# EAGLE design schemat (EAGLE 5.11)
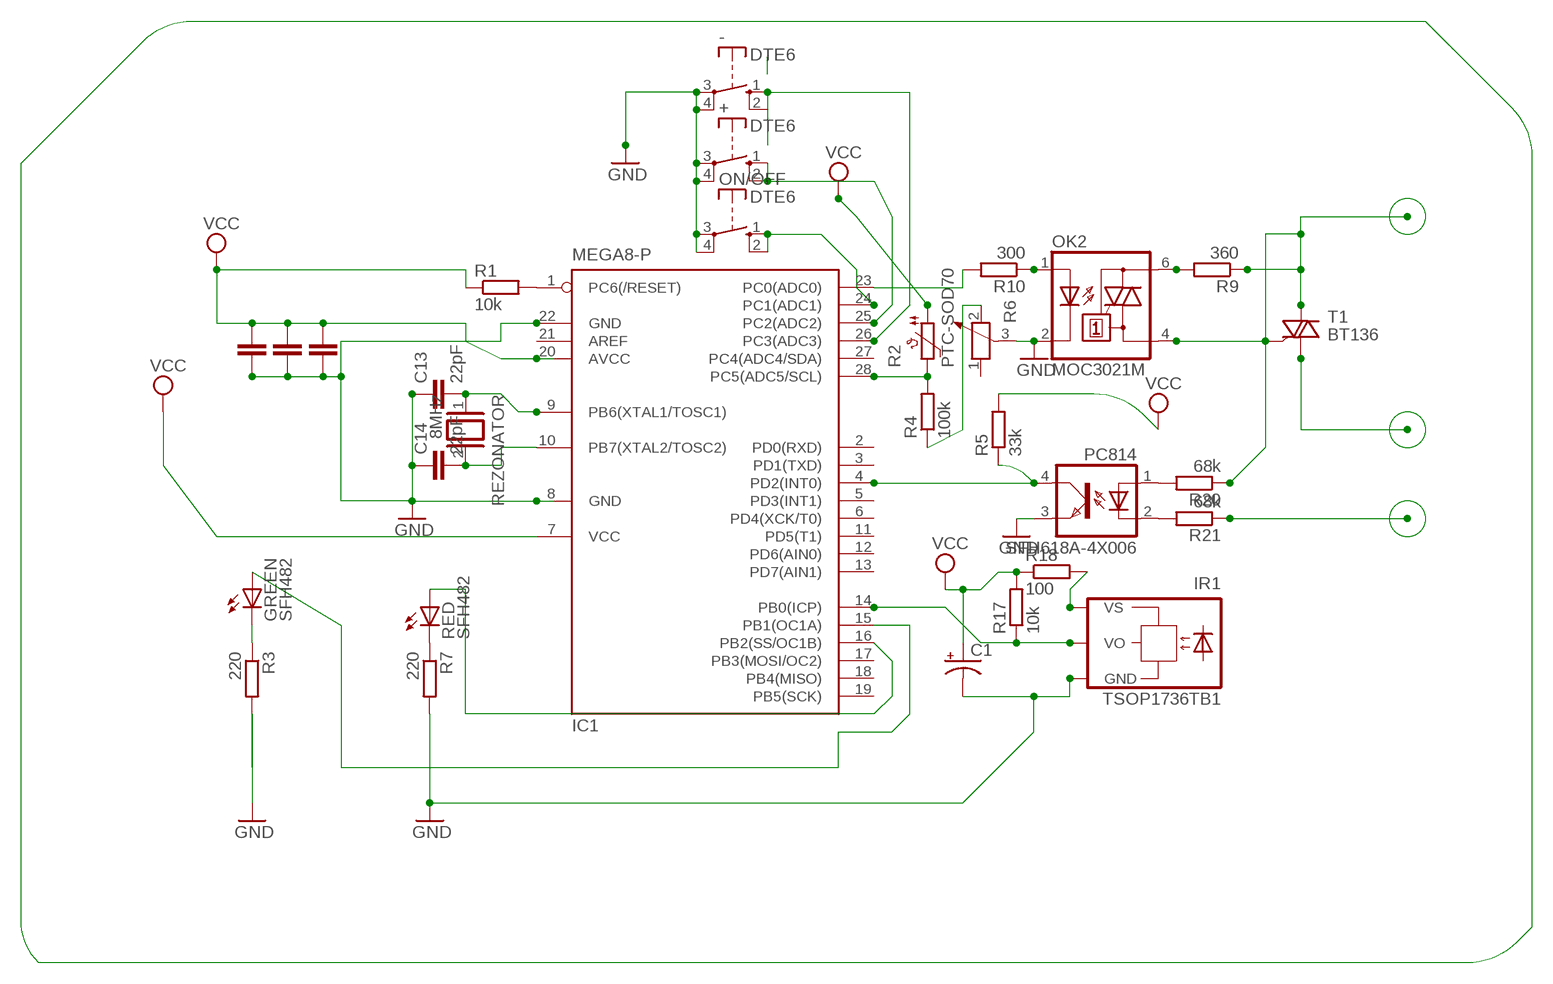
[diagram p0: schematic, sheet 1]

## Parts
+  DTE6  [DTE6]
-  DTE6  [DTE6]
C1  CPOL-USE2.5-7  [E2,5-7]
C13  22pF  C-EU050-024X044  [C050-024X044]
C14  22pF  C-EU050-024X044  [C050-024X044]
GREEN  SFH482  [SFH482]
IC1  MEGA8-P  [DIL28-3]
IR1  TSOP1736TB1  [TSOP17_TB1]
OK2  MOC3021M  [DIL06]
ON/OFF  DTE6  [DTE6]
PC814  SFH618A-4X006  [DIP4-400]
R1  10k  R-EU_0204/2V  [0204V]
R2  PTC-SOD70  [SOD70]
R3  220  R-EU_0309/12  [0309/12]
R4  100k  R-EU_0309/12  [0309/12]
R5  33k  R-EU_0309/12  [0309/12]
R6  POTENTIOMETER_PT-10  [PT-10]
R7  220  R-EU_0309/12  [0309/12]
R9  360  R-EU_0309/12  [0309/12]
R10  300  R-EU_0309/12  [0309/12]
R17  10k  R-EU_0309/12  [0309/12]
R18  100  R-EU_0309/12  [0309/12]
R20  68k  R-EU_0309/12  [0309/12]
R21  68k  R-EU_0309/12  [0309/12]
RED  SFH482  [SFH482]
REZONATOR  8MHz  XTAL/S  [QS]
T1  BT136  [TO220AB]

## Nets
GND: +.3(P) +.4(P) -.3(P) -.4(P) C1.- C13.1 C14.1 IC1.8(GND) IC1.22(GND) IR1.GND OK2.2(C) ON/OFF.3(P) ON/OFF.4(P) PC814.3(EMIT) R3.2 R6.3 R7.2
N$1: IC1.1(PC6(/RESET)) R1.2
N$2: C14.2 IC1.10(PB7(XTAL2/TOSC2)) REZONATOR.2
N$3: C13.2 IC1.9(PB6(XTAL1/TOSC1)) REZONATOR.1
N$4: IC1.23(PC0(ADC0)) R10.2
N$5: R9.1 R20.1 T1.2(A2)
N$6: OK2.4(A1) T1.3(G)
N$7: T1.1(A1)
N$8: PC814.1(A) R20.2
N$9: PC814.2(C) R21.2
N$10: IC1.4(PD2(INT0)) PC814.4(COL) R5.1
N$12: R21.1
N$14: IC1.14(PB0(ICP)) IR1.VO R17.1
N$16: IR1.VS R18.2
N$17: -.1(S) -.2(S) IC1.26(PC3(ADC3))
N$18: GREEN.A IC1.15(PB1(OC1A))
N$19: IC1.24(PC1(ADC1)) ON/OFF.1(S) ON/OFF.2(S)
N$20: IC1.28(PC5(ADC5/SCL)) R2.2 R4.2
N$21: IC1.16(PB2(SS/OC1B)) RED.A
N$22: GREEN.K(C) R3.1
N$23: R7.1 RED.K(C)
N$24: +.1(S) +.2(S) IC1.25(PC2(ADC2))
N$25: OK2.6(A2) R9.2
N$26: OK2.1(A) R10.1
N$31: R4.1 R6.2
VCC: C1.+ IC1.7(VCC) IC1.20(AVCC) R1.1 R2.1 R5.2 R17.2 R18.1
Unconnected: IC1.2(PD0(RXD)) IC1.3(PD1(TXD)) IC1.5(PD3(INT1)) IC1.6(PD4(XCK/T0)) IC1.11(PD5(T1)) IC1.12(PD6(AIN0)) IC1.13(PD7(AIN1)) IC1.17(PB3(MOSI/OC2)) IC1.18(PB4(MISO)) IC1.19(PB5(SCK)) IC1.21(AREF) IC1.27(PC4(ADC4/SDA)) R6.1

## Library data of the parts
+ - ON/OFF = switch-misc:DT: ITT SWITCH
C1 = rcl:CPOL-US: POLARIZED CAPACITOR, American symbol
C13 C14 = rcl:C-EU: CAPACITOR, European symbol
GREEN RED = led:SFH482: IR LED infrared emitting diode, Infineon
IC1 = atmel:MEGA8-P: MICROCONTROLLER 8 Kbytes FLASH, 1 kbytes SRAM, 512 bytes EEPROM, USART, 4-channel 10 bit ADC, 2-channel 8 bit ADC Pin compatible with Atmega48, ATMega88, ATMega168 Source: avr.lbr; OC_FARNELL: unknown; OC_NEWARK: unknown
IR1 = telefunken:TSOP17*TB1: TSOP17..TB1 IR Receiver Modules for Remote Control Systems Source: http://www.vishay.com/docs/82042/82042.pdf; OC_FARNELL: unknown; OC_NEWARK: unknown
OK2 = optocoupler:MOC30*M: RANDOM-PHASE OPTOISOLATORS TRIAC DRIVER OUTPUT Source: http://www.fairchildsemi.com MOC3020-M.pdf; MF: FAIRCHILD SEMICONDUCTOR; MPN: MOC3021-M; OC_FARNELL: 1021365; OC_NEWARK: 95B7895
PC814 = optocoupler:SFH618?*: Optocoupler, Phototransistor Output, Low Input Current Source: http://www.vishay.com/docs/83673/sfh618.pdf; OC_FARNELL: unknown; OC_NEWARK: unknown
R1 = resistor:R-EU_: RESISTOR, European symbol
R2 = ptc-ntc:PTC-: Positive Temperature Coefficient Resistor (PTC) termistor Philips KTY81-210 - KTY81-252 Source: 153627-da-01-en-Temperatur-Sensor_KTY10-6_Philips.pdf; OC_FARNELL: unknown; OC_NEWARK: unknown
R3-R5 R7 R9 R10 R17 R18 R20 R21 = rcl:R-EU_: RESISTOR, European symbol
R6 = rcl:POTENTIOMETER_: Potentiometer
REZONATOR = special:XTAL/S: CRYSTAL
T1 = triac:BT136: Triac BT136 series E sensitive gate Source: http://www.nxp.com/acrobat_download/datasheets/BT136_SERIES_E_2.pdf

## Board
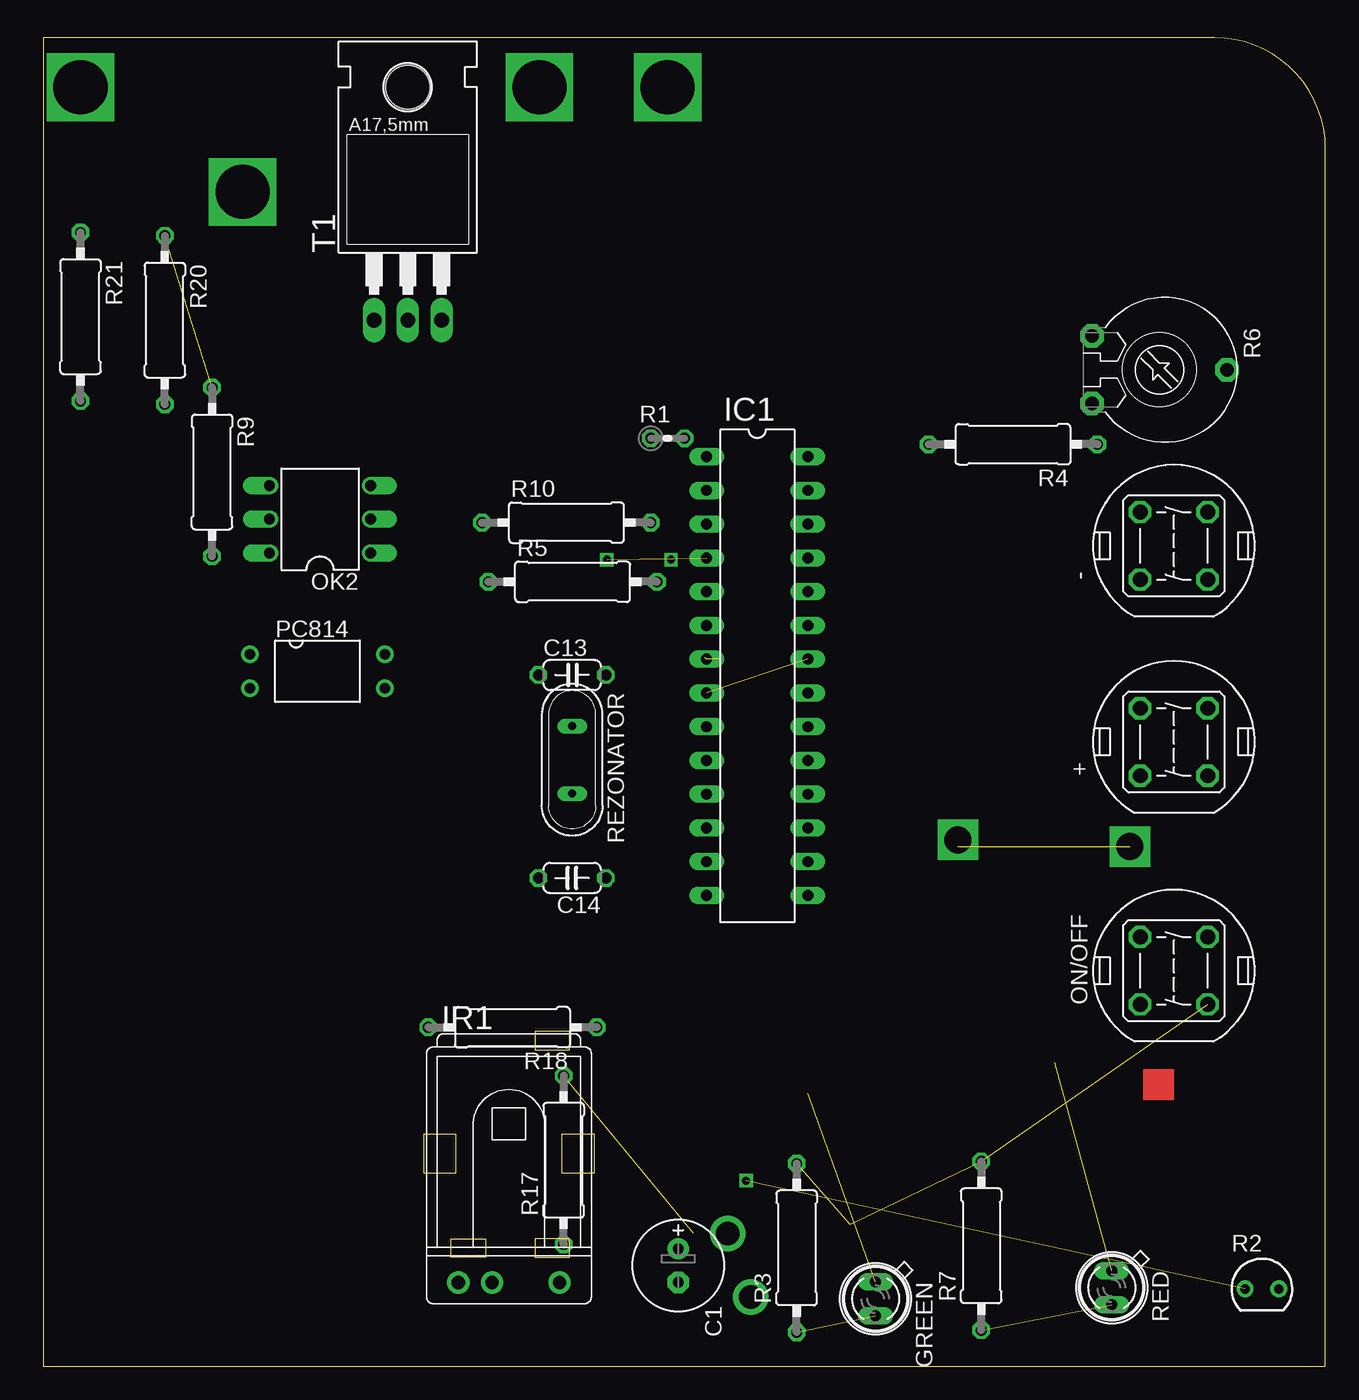
[diagram p1: board, top side]
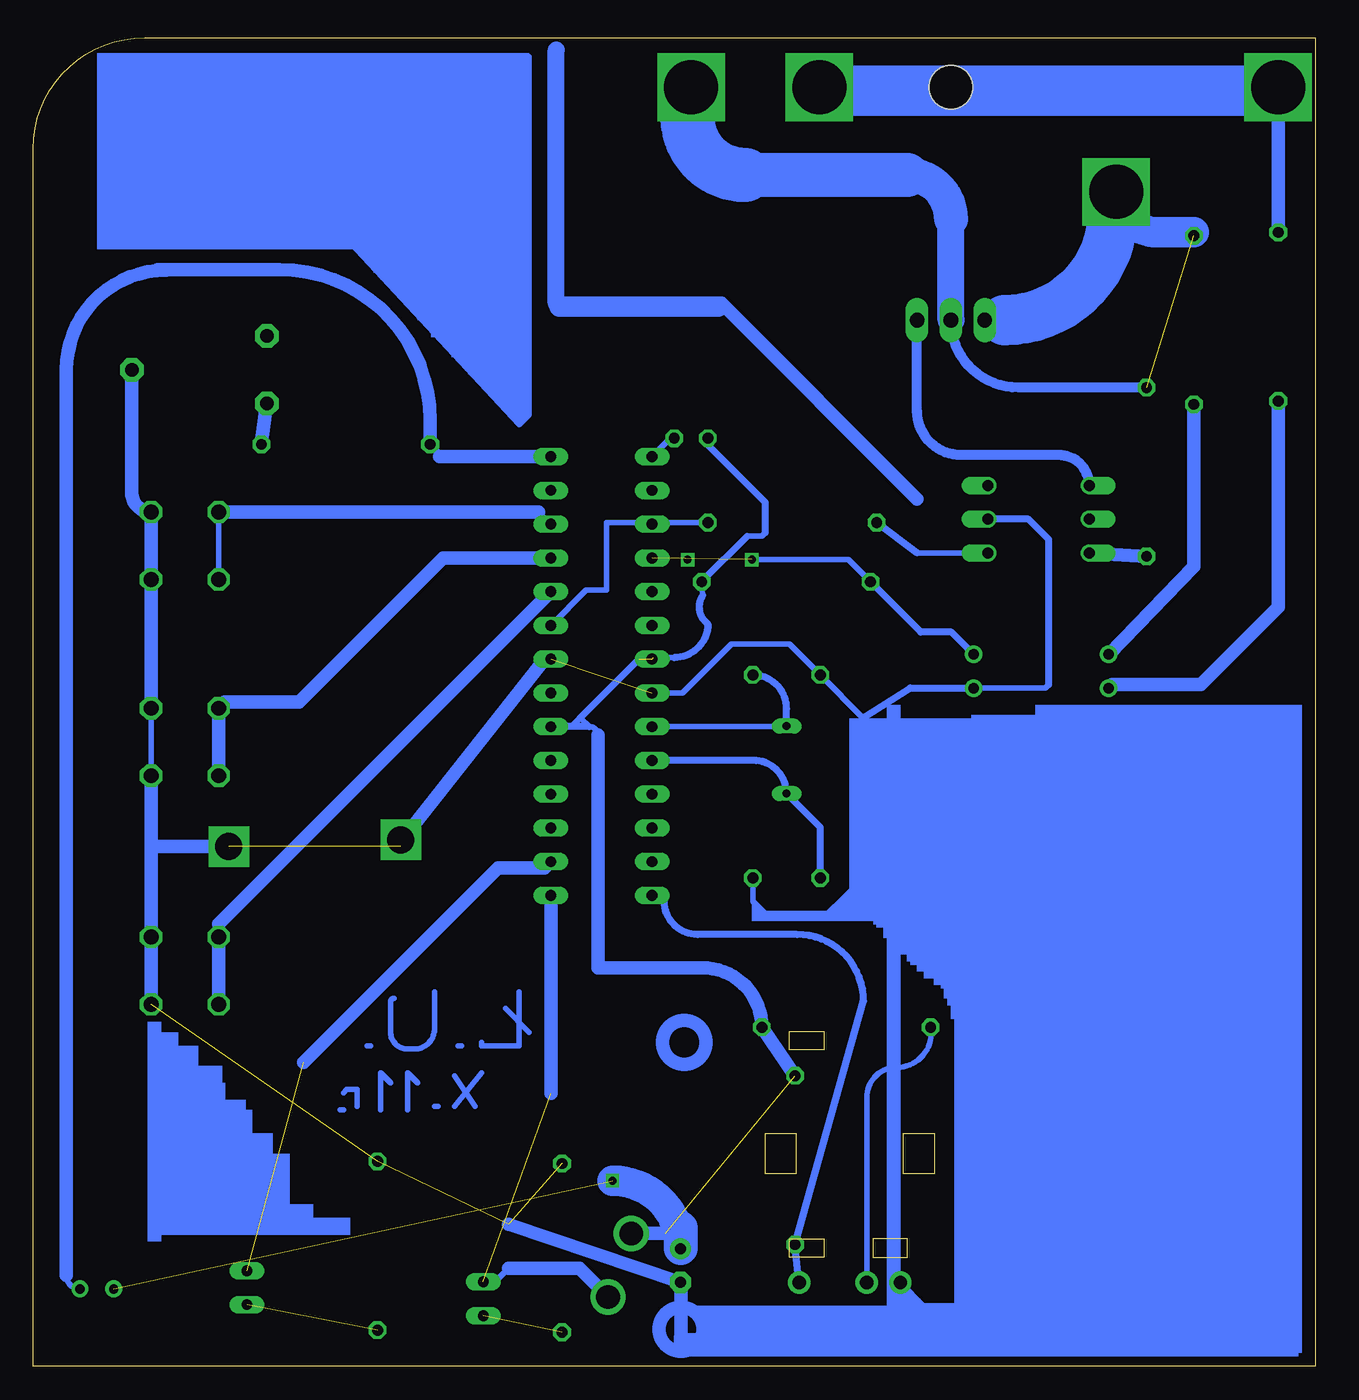
[diagram p2: board, bottom side, seen from below]

Size 96.5 x 100 mm. Coordinates in mm from the lower left corner, seen from the top.
Outline: 96.5,0 96.5,91.62 arc90 88.12,100 0,100 0,0 96.5,0
Copper layers (1*16): Top 0.035mm / dielectric 1.5mm / Bottom 0.035mm
Design rules "default": minimum track width 10mil, minimum drill 24mil, track to track 8mil, track to pad 8mil, pad to pad 8mil, via to via 8mil, smd to smd 8mil, copper to edge 40mil, drill to drill 8mil, minimum pad ring 10mil, minimum via ring 8mil, stop-mask expansion 4mil, vias tented up to drill 0mil, thermal gap 10mil

### Footprints (pad centres in the part's own frame; a part is rotated, then mirrored left to right if it is on the bottom)
DTE6 = drill 1.118 octagon: 1 -2.54,2.54; 2 2.54,2.54; 3 2.54,-2.54; 4 -2.54,-2.54
E2,5-7 = drill 0.813 pad 1.6 round: + -1.27,0 | drill 0.813 pad 1.6 octagon: - 1.27,0
C050-024X044 = drill 0.813 octagon: 1 -2.54,0; 2 2.54,0
SFH482 = drill 0.813 long: A -1.27,0; K 1.27,0
DIL28-3 = drill 0.813 long: 1 -16.51,-3.81; 2 -13.97,-3.81; 3 -11.43,-3.81; 4 -8.89,-3.81; 5 -6.35,-3.81; 6 -3.81,-3.81; 7 -1.27,-3.81; 8 1.27,-3.81; 9 3.81,-3.81; 10 6.35,-3.81; 11 8.89,-3.81; 12 11.43,-3.81; 13 13.97,-3.81; 14 16.51,-3.81; 15 16.51,3.81; 16 13.97,3.81; 17 11.43,3.81; 18 8.89,3.81; 19 6.35,3.81; 20 3.81,3.81; 21 1.27,3.81; 22 -1.27,3.81; 23 -3.81,3.81; 24 -6.35,3.81; 25 -8.89,3.81; 26 -11.43,3.81; 27 -13.97,3.81; 28 -16.51,3.81
TSOP17_TB1 = drill 1 pad 1.676 round: GND 0,-3.81; VO 0,3.81; VS 0,-1.27
DIL06 = drill 0.813 offset: 1 -2.54,-3.81; 2 0,-3.81; 3 2.54,-3.81; 4 2.54,3.81; 5 0,3.81; 6 -2.54,3.81
DIP4-400 = drill 0.8 round: 1 -1.27,-5.08; 2 1.27,-5.08; 3 1.27,5.08; 4 -1.27,5.08
0204V = drill 0.813 octagon: 1 -1.27,0; 2 1.27,0
SOD70 = drill 0.7 pad 1.27 round: 1 -1.27,0; 2 1.27,0
0309/12 = drill 0.813 octagon: 1 -6.35,0; 2 6.35,0
PT-10 = drill 1.016 pad 1.778 octagon: 1 -2.54,-5.08; 2 2.54,-5.08; 3 0,5.08
QS = drill 0.61 long: 1 -2.54,0; 2 2.54,0
TO220AB = drill 1.118 long: 1 -2.54,-6.35; 2 0,-6.35; 3 2.54,-6.35 | hole 3.302: 0,11.176

### Placement (x,y rotation side)
+  85.09,46.99 90 top
-  85.09,61.75 90 top
C1  47.78,7.58 270 top
C13  39.8,52.03 0 top
C14  39.8,36.75 180 top
GREEN  62.63,5.08 270 top
IC1  53.73,51.95 270 top
IR1  35.04,6.31 270 top
OK2  20.83,63.75 90 top
ON/OFF  85.09,29.77 90 top
PC814  20.63,52.31 270 top
R1  46.99,69.85 0 top
R2  91.71,5.82 0 top
R3  56.7,8.91 90 top
R4  72.98,69.39 180 top
R5  39.84,59.04 0 top
R6  84,75 270 top
R7  70.59,9.07 90 top
R9  12.7,67.31 270 top
R10  39.37,63.5 0 top
R17  39.16,15.51 90 top
R18  35.31,25.51 180 top
R20  9.14,78.74 270 top
R21  2.79,78.99 270 top
RED  80.41,5.91 270 top
REZONATOR  39.8,45.64 270 top
T1  27.43,85.09 0 top

### Tracks (layer width: path | path; a pad name or v marks a point on that pad's centre or on a via)
GND  (4 unrouted)
  Bottom 0.406: +.4 +.3 | PC814.3 20.33,51.04 20.07,51.31 | IC1.8 47.62,50.68 43.94,54.36 39.59,54.36 C13.1 34.04,48.81 34.04,36.75 35.56,35.23 | 35.56,35.23 35.56,34.04 26.92,34.04 23.62,30.73 23.62,4.83 23.88,4.57 29.49,4.57 IR1.GND | 87.63,38.86 arc90 87.38,39.12 | 47.75,6.28 C1.- | 47.75,2.29 30.73,2.29 31.23,2.78 | 35.56,35.23 36.75,34.04 41.4,34.04 42.34,34.97 C14.1
  Bottom 0.508: 20.07,51.31 20.07,62.23 21.59,63.75 OK2.2 | 34.04,48.81 30.48,51.05 PC814.3
  Bottom 0.762: IR1.GND 31.23,2.78
  Bottom 1.016: ON/OFF.4 ON/OFF.3 87.63,38.86 +.4 | +.3 -.4 -.3 arc90 89.08,65.74 R6.3 | C1.- 60.71,10.67 | 87.38,39.12 82.04,39.12 | 47.75,2.29 47.75,6.28
INL  (via drill 4.06)
  Bottom 0.406: 2.79,85.34 3.05,85.09
  Bottom 1.016: 2.79,85.34 v2.79,96.27
L  (via drill 4.06)
  other vias: 46.99,96.27
N  (via drill 4.06)
  other vias: 37.34,96.27
N$1
  Bottom 0.406: IC1.1 48.53,69.85 R1.2
N$2
  Bottom 0.508: C14.2 37.26,40.56 REZONATOR.2 arc-90 42.3,45.6 IC1.10
N$3
  Bottom 0.406: REZONATOR.1 arc90 39.84,48.14 IC1.9
  Bottom 0.508: C13.2 arc90 39.8,49.49 REZONATOR.1
N$4
  Bottom 0.406: R10.2 53.34,63.5 53.34,58.42 54.88,58.42 IC1.23
N$5  (1 unrouted)
  Bottom 0.762: R9.1 22.35,73.66 arc90 T1.2
  Bottom 2.032: T1.2 27.43,86.36
  Bottom 2.54: 27.43,86.36 arc-90 30.73,89.66
  Bottom 3.302: 30.73,89.66 42.93,89.66
  Bottom 4.064: 42.93,89.66 arc90 47.24,93.98
N$6
  Bottom 0.762: OK2.4 arc-90 19.3,68.58 26.67,68.58 arc90 29.97,71.88 T1.3
N$8
  Bottom 1.016: PC814.1 9.16,60.18 R20.2
N$9
  Bottom 0.406: 15.28,51.31 PC814.2
  Bottom 1.016: R21.2 2.79,57.15 8.64,51.31 15.28,51.31
N$10  (1 unrouted)
  Bottom 0.406: R5.1 35.15,60.71 42.42,60.71
  Bottom 0.508: PC814.4 27.39,55.26 29.7,55.26 R5.1
N$14
  Bottom 0.406: 49,35 arc-90 49.44,35.44 IC1.14
  Bottom 0.508: IR1.VO R17.1 34,27.5 arc-90 39,32.5 46.5,32.5 arc90 49,35
N$15  (via drill 1.78)
  other vias: 51.5,10
N$16
  Bottom 0.406: IR1.VS 33.77,20.23 arc90 31.5,22.5 arc-100 R18.2
N$17
  Bottom 0.406: IC1.26 58.45,64.29 | -.2 -.1
  Bottom 1.016: 58.45,64.29 -.2
N$18  (1 unrouted)
  Bottom 1.016: 57.54,20.52 IC1.15
N$19
  Bottom 0.406: ON/OFF.2 82.55,33.29
  Bottom 1.016: ON/OFF.1 ON/OFF.2 | 82.55,33.29 IC1.24
N$20
  Bottom 0.406: R2.2 arc90 94,6.84 | R4.2 66.04,68.8 66.04,68.58 65.92,68.46 | 87.38,82.55 87.12,82.55 arc-90 87.07,82.5 86.5,82.5
  Bottom 1.016: 86.5,82.5 arc-90 94,75 94,6.84 | 65.92,68.46 IC1.28 | R4.2 66.63,71.2 arc-90 77.98,82.55 87.12,82.55
N$21  (1 unrouted)
  Bottom 1.016: 76.14,22.86 61.5,37.5 58.02,37.5 IC1.16
N$22  (1 unrouted)
N$23  (1 unrouted)
N$24
  Bottom 0.406: 82.08,50 +.2
  Bottom 1.016: +.2 +.1 | 82.08,50 76.5,50 65.66,60.84 IC1.25
N$25
  Bottom 1.016: R9.2 OK2.6
N$26
  Bottom 0.406: OK2.1 29.97,61.21
  Bottom 0.508: 29.97,61.21 R10.1
N$30  (via drill 1.78)
  other vias: 53.24,5.21
N$31
  Bottom 1.016: R4.1 R6.2
N$32  (via drill 0.6)
  other vias: 42.42,60.71
N$33  (via drill 0.6)
  other vias: 47.24,60.71
N$34
  Bottom 0.406: 46.23,2.54 arc-90 45.97,2.29 26.16,2.29 arc-90 22.35,6.1 22.35,19.3 | 22.35,19.3 22.35,22.35 | 22.35,19.3 arc90 22.61,19.05
N$35  (via drill 4.06)
  other vias: 14.99,88.39
N$36
  Bottom 2.54: 47.75,8.89 47.75,10.41
N$37  (via drill 2.03)  (1 unrouted)
  Bottom 0.406: v81.79,39.12 82.3,39.12 82.8,38.61 | 68.58,38.86 68.83,39.12 v68.83,39.62
N$38
  Bottom 1.016: 68.33,40.13 57.91,53.34
N$39
  pour Bottom: 24.38,25.91 25.91,25.91 31.24,31.24 34.8,34.8 34.8,48.26 34.29,48.77 25.4,48.77 24.38,47.75
N$42
  Bottom 2.286: 9.14,85.34 11.94,85.34 arc90 14.73,88.14
N$43
  Bottom 0.406: 36.83,96.01 arc90 37.34,96.52
  Bottom 3.81: 3.05,96.01 36.83,96.01
N$44
  Bottom 1.016: 29.97,65.28 44.7,80.01
N$45
  Bottom 0.406: 23.37,78.74 24.64,78.74
  Bottom 3.81: 15.24,86.87 arc90 23.37,78.74
N$46
  Bottom 0.406: 56.9,79.76 arc90 57.15,80.01
  Bottom 1.27: 57.15,80.01 57.15,99.06
  Bottom 1.524: 44.96,79.76 56.9,79.76
N$47
  Bottom 0.406: 72.64,84.58 59.94,70.87 59.18,71.63 59.18,98.55 59.44,98.3 65.53,98.3
N$48
  Bottom 0.406: 60.71,7.37 61.72,6.35 62.74,6.35
  Bottom 1.016: 53.34,5.33 55.37,7.37 60.71,7.37
S$1
  Bottom 0.406: 59.94,28.19 59.94,24.13 62.74,24.13 62.74,24.38
S$2
  Bottom 0.406: 59.18,25.15 60.96,26.92
S$3
  Bottom 0.406: 64.26,24.13 64.52,24.13
S$4
  Bottom 0.406: 66.29,28.19 66.29,25.4 arc90 67.82,23.88 68.33,23.88 arc90 69.6,25.15 69.6,27.43 arc90 69.34,27.69
S$5
  Bottom 0.406: 71.12,24.13 71.37,24.13
S$6
  Bottom 0.406: 62.74,22.1 64.77,19.56
S$7
  Bottom 0.406: 63.25,19.56 64.77,21.84
S$8
  Bottom 0.406: 66.04,19.56 66.29,19.56
S$9
  Bottom 0.406: 67.56,21.34 68.33,22.1 68.33,19.3
S$10
  Bottom 0.406: 69.6,21.34 70.36,22.1 70.36,19.3
S$11
  Bottom 0.406: 72.14,19.56 72.14,20.83 72.9,20.83 73.15,20.57
S$12
  Bottom 0.406: 73.15,19.3 73.41,19.3
VCC  (via drill 0.6)  (4 unrouted)
  Bottom 0.406: 54,47.5 arc-90 54.64,48.14 55.27,48.77 55.37,48.77 55.88,48.26 | R5.2 46.11,58.03 | 48.26,53.34 49.8,53.34 | 42.75,62.48 41.66,62.48 41.4,62.74 | 45.72,69.34 R1.1 | C1.+ arc-90 48.93,10
  Bottom 0.508: 54.64,48.14 IC1.20 | 46.11,58.03 arc-90 45.72,55.88 arc90 48.26,53.34 | 42.75,62.48 R5.2 | 41.4,62.74 41.4,65.02 45.72,69.34 | 55.37,48.77 50.92,53.22
  Bottom 1.016: R17.2 R18.1 arc-90 46.15,30 54,30 54,47.5 | 48.93,10 51.5,10
  Bottom 2.286: C1.+ arc-90 v52.9,13.97
(copper drawn outside any net)
  shapes: Bottom area x106, Bottom circle x19, Top area x1